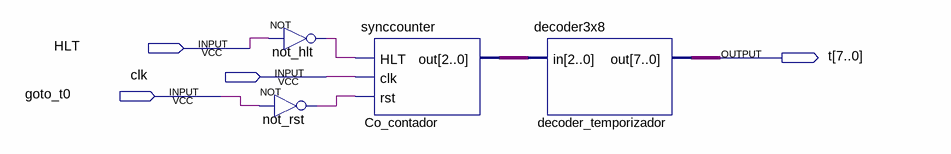
[diagram p0: schematic sheet]
// Quartus schematic temporizador.bdf as structural Verilog: 4 symbols, 4 pins
module temporizador (
  input  HLT,
  input  clk,
  input  goto_t0,
  output [7:0] t
);

  wire not_hlt_out, not_rst_out;
  wire [2:0] Co_contador_out;

  not not_hlt (not_hlt_out, HLT);
  not not_rst (not_rst_out, goto_t0);
  synccounter Co_contador (.HLT(not_hlt_out), .clk(clk), .rst(not_rst_out), .out(Co_contador_out));
  decoder3x8 decoder_temporizador (.in(Co_contador_out), .out(t));
endmodule
